# Altium project Peripheral_Board.PrjPcb
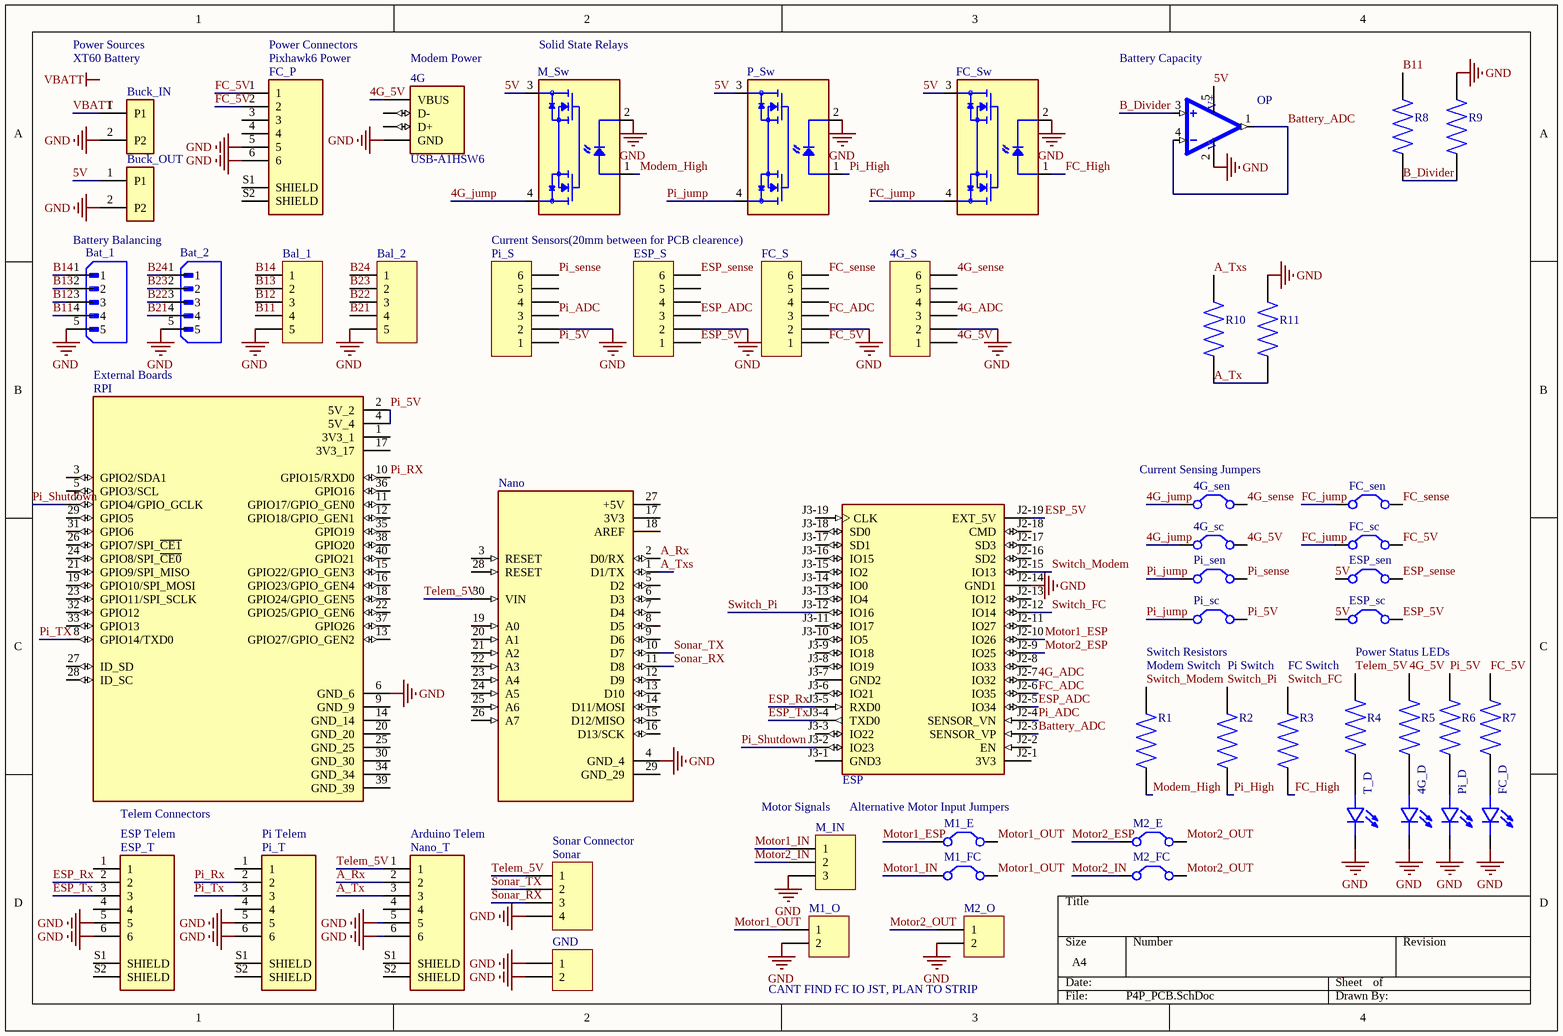
[diagram p0: P4P_PCB.SchDoc]
1 sheet, 54 parts. Net scope: global (net labels, ports and power ports of the same name join across sheets).
Board file: Peripheral_PCB.PcbDoc

## Sheet P4P_PCB.SchDoc
size A4; SheetNumber: 1; SheetTotal: 1

### Parts
4G  USB-A1HSW6  [OST_USB-A1HSW6]
4G_D  SM0603UYC  [LED_SM0603UYC]  (value not drawn)
4G_S  Header 6H  [HDR1X6H]  (value not drawn)
4G_sc  (no value)  [RAD-0.2]
4G_sen  (no value)  [RAD-0.2]
Bal_1  Header 5  [HDR1X5]  (value not drawn)
Bal_2  Header 5  [HDR1X5]  (value not drawn)
Bat_1  B5B-XH-A  [JST_B5B-XH-A]  (value not drawn)
Bat_2  B5B-XH-A  [JST_B5B-XH-A]  (value not drawn)
Buck_IN  1776275-2  [TE_1776275-2]  (value not drawn)
Buck_OUT  1776275-2  [TE_1776275-2]  (value not drawn)
ESP  ESP32-DEVKITC-32D  [MODULE_ESP32-DEVKITC-32D]  (value not drawn)
ESP_S  Header 6H  [HDR1X6H]  (value not drawn)
ESP_sc  (no value)  [RAD-0.2]
ESP_sen  (no value)  [RAD-0.2]
ESP_T  BM06B-GHS-TBT(LF)(SN)(N)  [JST_BM06B-GHS-TBT(LF)(SN)(N)]  (value not drawn)
FC_D  SM0603UYC  [LED_SM0603UYC]  (value not drawn)
FC_P  BM06B-GHS-TBT(LF)(SN)(N)  [JST_BM06B-GHS-TBT(LF)(SN)(N)]  (value not drawn)
FC_S  Header 6H  [HDR1X6H]  (value not drawn)
FC_sc  (no value)  [RAD-0.2]
FC_sen  (no value)  [RAD-0.2]
FC_Sw  G3VM-61VY3  [RELAY_G3VM-61VY3]  (value not drawn)
GND  Header 2  [HDR1X2]  (value not drawn)
M1_E  (no value)  [RAD-0.2]
M1_FC  (no value)  [RAD-0.2]
M1_O  Header 2  [HDR1X2]  (value not drawn)
M2_E  (no value)  [RAD-0.2]
M2_FC  (no value)  [RAD-0.2]
M2_O  Header 2  [HDR1X2]  (value not drawn)
M_IN  Header 3  [HDR1X3]  (value not drawn)
M_Sw  G3VM-61VY3  [RELAY_G3VM-61VY3]  (value not drawn)
Nano  ARDUINO_NANO  [MODULE_ARDUINO_NANO]  (value not drawn)
Nano_T  BM06B-GHS-TBT(LF)(SN)(N)  [JST_BM06B-GHS-TBT(LF)(SN)(N)]  (value not drawn)
OP  MCP6001T-I/OT  [SOT95P270X145-5N]  (value not drawn)
P_Sw  G3VM-61VY3  [RELAY_G3VM-61VY3]  (value not drawn)
Pi_D  SM0603UYC  [LED_SM0603UYC]  (value not drawn)
Pi_S  Header 6H  [HDR1X6H]  (value not drawn)
Pi_sc  (no value)  [RAD-0.2]
Pi_sen  (no value)  [RAD-0.2]
Pi_T  BM06B-GHS-TBT(LF)(SN)(N)  [JST_BM06B-GHS-TBT(LF)(SN)(N)]  (value not drawn)
R1  CR0805AJ/-000EAS  [RESC2012X60N]  (value not drawn)
R2  CR0805AJ/-000EAS  [RESC2012X60N]  (value not drawn)
R3  CR0805AJ/-000EAS  [RESC2012X60N]  (value not drawn)
R4  CR0805AJ/-000EAS  [RESC2012X60N]  (value not drawn)
R5  CR0805AJ/-000EAS  [RESC2012X60N]  (value not drawn)
R6  CR0805AJ/-000EAS  [RESC2012X60N]  (value not drawn)
R7  CR0805AJ/-000EAS  [RESC2012X60N]  (value not drawn)
R8  CR0805AJ/-000EAS  [RESC2012X60N]  (value not drawn)
R9  CR0805AJ/-000EAS  [RESC2012X60N]  (value not drawn)
R10  CR0805AJ/-000EAS  [RESC2012X60N]  (value not drawn)
R11  CR0805AJ/-000EAS  [RESC2012X60N]  (value not drawn)
RPI  RASPBERRY_PI_ZERO_2_W  [MODULE_RASPBERRY_PI_ZERO_2_W]  (value not drawn)
Sonar  Header 4  [HDR1X4]  (value not drawn)
T_D  SM0603UYC  [LED_SM0603UYC]  (value not drawn)

### Nets
GND: 4G.4(GND) 4G_D.C 4G_S.2 Bal_1.5 Bal_2.5 Bat_1.5 Bat_2.5 Buck_IN.2(P2) Buck_OUT.2(P2) ESP.J2-14(GND1) ESP_S.2 ESP_T.5 ESP_T.6 FC_D.C FC_P.5 FC_P.6 FC_S.2 FC_Sw.2(C) GND.1 GND.2 M1_O.2 M2_O.2 M_IN.3 M_Sw.2(C) Nano.4(GND_4) Nano_T.5 Nano_T.6 OP.2(VSS) P_Sw.2(C) Pi_D.C Pi_S.2 Pi_T.5 Pi_T.6 R9.2 R11.2 RPI.6(GND_6) Sonar.4 T_D.C
VBATT: Buck_IN.1(P1)
4G_5V: 4G.1(VBUS) 4G_S.1 4G_sc.2(C2) R5.2
4G_ADC: 4G_S.3 ESP.J2-7(IO32)
4G_jump: 4G_sc.1(C1) 4G_sen.1(C1) M_Sw.4(D1)
4G_sense: 4G_S.6 4G_sen.2(C2)
5V: Buck_OUT.1(P1) ESP_sc.1(C1) ESP_sen.1(C1) FC_Sw.3(D2) M_Sw.3(D2) OP.5(VDD) P_Sw.3(D2)
A_Rx: Nano.2(D0/RX) Nano_T.2
A_Tx: Nano_T.3 R10.2 R11.1
A_Txs: Nano.1(D1/TX) R10.1
B11: Bal_1.4 Bat_1.4 R8.1
B12: Bal_1.3 Bat_1.3
B13: Bal_1.2 Bat_1.2
B14: Bal_1.1 Bat_1.1
B21: Bal_2.4 Bat_2.4
B22: Bal_2.3 Bat_2.3
B23: Bal_2.2 Bat_2.2
B24: Bal_2.1 Bat_2.1
B_Divider: OP.3(VIN+) R8.2 R9.1
Battery_ADC: ESP.J2-3(SENSOR_VP) OP.1(VOUT) OP.4(VIN-)
ESP_5V: ESP.J2-19(EXT_5V) ESP_S.1 ESP_sc.2(C2)
ESP_ADC: ESP.J2-5(IO34) ESP_S.3
ESP_Rx: ESP.J3-5(RXD0) ESP_T.2
ESP_sense: ESP_S.6 ESP_sen.2(C2)
ESP_Tx: ESP.J3-4(TXD0) ESP_T.3
FC_5V: FC_P.1 FC_P.2 FC_S.1 FC_sc.2(C2) R7.2
FC_ADC: ESP.J2-6(IO35) FC_S.3
FC_High: FC_Sw.1(A) R3.1
FC_jump: FC_sc.1(C1) FC_sen.1(C1) FC_Sw.4(D1)
FC_sense: FC_S.6 FC_sen.2(C2)
Modem_High: M_Sw.1(A) R1.1
Motor1_ESP: ESP.J2-10(IO26) M1_E.1(C1)
Motor1_IN: M1_FC.1(C1) M_IN.1
Motor1_OUT: M1_E.2(C2) M1_FC.2(C2) M1_O.1
Motor2_ESP: ESP.J2-9(IO25) M2_E.1(C1)
Motor2_IN: M2_FC.1(C1) M_IN.2
Motor2_OUT: M2_E.2(C2) M2_FC.2(C2) M2_O.1
Pi_5V: Pi_S.1 Pi_sc.2(C2) R6.2 RPI.2(5V_2) RPI.4(5V_4)
Pi_ADC: ESP.J2-4(SENSOR_VN) Pi_S.3
Pi_High: P_Sw.1(A) R2.1
Pi_jump: P_Sw.4(D1) Pi_sc.1(C1) Pi_sen.1(C1)
Pi_RX: Pi_T.2 RPI.10(GPIO15/RXD0)
Pi_sense: Pi_S.6 Pi_sen.2(C2)
Pi_Shutdown: ESP.J3-2(IO23) RPI.7(GPIO4/GPIO_GCLK)
Pi_TX: Pi_T.3 RPI.8(GPIO14/TXD0)
Sonar_RX: Nano.11(D8) Sonar.3
Sonar_TX: Nano.10(D7) Sonar.2
Switch_FC: ESP.J2-12(IO14) R3.2
Switch_Modem: ESP.J2-15(IO13) R1.2
Switch_Pi: ESP.J3-12(IO16) R2.2
Telem_5V: Nano.30(VIN) Nano_T.1 R4.2 Sonar.1
Net4G_D_A: 4G_D.A R5.1
NetFC_D_A: FC_D.A R7.1
NetPi_D_A: Pi_D.A R6.1
NetR4_1: R4.1 T_D.A

Not connected (* = marked no-connect by the designer): 4G 2(D-) 3(D+); 4G_S 4 5; ESP J2-1(3V3) J2-2(EN) J2-8(IO33) J2-11(IO27) J2-13(IO12) J2-16(SD2) J2-17(SD3) J2-18(CMD) J3-1(GND3) J3-3(IO22) J3-6(IO21) J3-7(GND2) J3-8(IO19) J3-9(IO18) J3-10(IO5) J3-11(IO17) J3-13(IO4) J3-14(IO0) J3-15(IO2) J3-16(IO15) J3-17(SD1) J3-18(SD0) J3-19(CLK); ESP_S 4 5; ESP_T 1 4 S1(SHIELD) S2(SHIELD); FC_P 3 4 S1(SHIELD) S2(SHIELD); FC_S 4 5; Nano 3(RESET) 5(D2) 6(D3) 7(D4) 8(D5) 9(D6) 12(D9) 13(D10) 14(D11/MOSI) 15(D12/MISO) 16(D13/SCK) 17(3V3) 18(AREF) 19(A0) 20(A1) 21(A2) 22(A3) 23(A4) 24(A5) 25(A6) 26(A7) 27(+5V) 28(RESET) 29(GND_29); Nano_T 4 S1(SHIELD) S2(SHIELD); Pi_S 4 5; Pi_T 1 4 S1(SHIELD) S2(SHIELD); RPI 1(3V3_1) 3(GPIO2/SDA1) 5(GPIO3/SCL) 9(GND_9) 11(GPIO17/GPIO_GEN0) 12(GPIO18/GPIO_GEN1) 13(GPIO27/GPIO_GEN2) 14(GND_14) 15(GPIO22/GPIO_GEN3) 16(GPIO23/GPIO_GEN4) 17(3V3_17) 18(GPIO24/GPIO_GEN5) 19(GPIO10/SPI_MOSI) 20(GND_20) 21(GPIO9/SPI_MISO) 22(GPIO25/GPIO_GEN6) 23(GPIO11/SPI_SCLK) 24(GPIO8/SPI_~{CE0}) 25(GND_25) 26(GPIO7/SPI_~{CE1}) 27(ID_SD) 28(ID_SC) 29(GPIO5) 30(GND_30) 31(GPIO6) 32(GPIO12) 33(GPIO13) 34(GND_34) 35(GPIO19) 36(GPIO16) 37(GPIO26) 38(GPIO20) 39(GND_39) 40(GPIO21)

### Notes on the sheet
- (near Buck_IN) XT60 Battery
- Power Sources
- (near FC_P) Pixhawk6 Power
- (near FC_P) Power Connectors
- (near 4G) Modem Power
- (near M_Sw) Solid State Relays
- (near OP) Battery Capacity
- Battery Balancing
- Current Sensors(20mm between for PCB clearence)
- External Boards
- (near 4G_sen) Current Sensing Jumpers
- (near Pi_sc) Switch Resistors
- Power Status LEDs
- Modem Switch
- Pi Switch
- FC Switch
- (near RPI) Telem Connectors
- ESP Telem
- Pi Telem
- (near Nano_T) Arduino Telem
- (near Sonar) Sonar Connector
- Motor Signals
- Alternative Motor Input Jumpers
- CANT FIND FC IO JST, PLAN TO STRIP
- Labels drawn without touching a wire or pin: VBATT
- (in symbol MCP6001T-I/OT) V+; V-

### Library data of the parts
4G = USB-A1HSW6: MF: {'manufacturer': u'On Shore Technology Inc.'}; Package: None; Price: None; Value: *; MP: USB-A1HSW6; Availability: Unavailable
4G_D FC_D Pi_D T_D = SM0603UYC: LED SMD 0603 Ultra Yellow 593nm 70mcd Water Clear Lens 130 Deg Viewing Angle | Bivar Inc. SM0603UYC; SnapEDA_Link: https://www.snapeda.com/parts/SM0603UYC/Bivar/view-part/?ref=snap; Package: 0603 Bivar; Value: *; MF: Bivar; MP: SM0603UYC; Check_prices: https://www.snapeda.com/parts/SM0603UYC/Bivar/view-part/?ref=eda
4G_S ESP_S FC_S Pi_S = Header 6H: Header, 6-Pin, Right Angle; LatestRevisionDate: 17-Jul-2002; LatestRevisionNote: Re-released for DXP Platform.; Publisher: Altium Limited
4G_sc 4G_sen ESP_sc ESP_sen FC_sc FC_sen M1_E M1_FC M2_E M2_FC Pi_sc Pi_sen = Jumper: Jumper Wire; Published: 24-Mar-1999; LatestRevisionDate: 17-Jul-2002; LatestRevisionNote: Re-released for DXP Platform.; PackageReference: RAD-0.2; Publisher: Altium Limited; PackageDescription: Radial Cap, Thru-Hole; 2 Leads; 0.2 in Pin Spacing
Bal_1 Bal_2 = Header 5: Header, 5-Pin; LatestRevisionDate: 17-Jul-2002; LatestRevisionNote: Re-released for DXP Platform.; Publisher: Altium Limited
Bat_1 Bat_2 = B5B-XH-A: Connector Header Through Hole 5 position 0.098 (2.50mm); MF: JST Sales; SnapEDA_Link: https://www.snapeda.com/parts/B5B-XH-A/JST+Sales+America+Inc./view-part/?ref=snap; Package: None; Value: *; MP: B5B-XH-A; Check_prices: https://www.snapeda.com/parts/B5B-XH-A/JST+Sales+America+Inc./view-part/?ref=eda
Buck_IN Buck_OUT = 1776275-2: 2 Position Wire to Board Terminal Block Horizontal with Board 0.138" (3.50mm) Through Hole; MF: TE Connectivity; Package: None; Price: None; Value: *; SnapEDA_Link: https://www.snapeda.com/parts/1776275-2/TE+Connectivity+AMP+Connectors/view-part/?ref=snap; MP: 1776275-2; Availability: Unavailable; Check_prices: https://www.snapeda.com/parts/1776275-2/TE+Connectivity+AMP+Connectors/view-part/?ref=eda
ESP = ESP32-DEVKITC-32D: WiFi Development Tools (802.11) ESP32 General Development Kit, ESP32-WROOM-32D on the board; MF: Espressif Systems; SnapEDA_Link: https://www.snapeda.com/parts/ESP32-DEVKITC-32D/Espressif+Systems/view-part/?ref=snap; Package: None; Value: *; MP: ESP32-DEVKITC-32D; Check_prices: https://www.snapeda.com/parts/ESP32-DEVKITC-32D/Espressif+Systems/view-part/?ref=eda
ESP_T FC_P Nano_T Pi_T = BM06B-GHS-TBT(LF)(SN)(N): Connector Header Surface Mount 6 position 0.049 (1.25mm); MF: JST Sales; SnapEDA_Link: https://www.snapeda.com/parts/BM06B-GHS-TBT(LF)(SN)(N)/JST/view-part/?ref=snap; Package: None; Value: *; MP: BM06B-GHS-TBT(LF)(SN)(N); Check_prices: https://www.snapeda.com/parts/BM06B-GHS-TBT(LF)(SN)(N)/JST/view-part/?ref=eda
GND M1_O M2_O = Header 2: Header, 2-Pin; LatestRevisionDate: 17-Jul-2002; LatestRevisionNote: Re-released for DXP Platform.; Publisher: Altium Limited
M_IN = Header 3: Header, 3-Pin; LatestRevisionDate: 17-Jul-2002; LatestRevisionNote: Re-released for DXP Platform.; Publisher: Altium Limited
Nano = ARDUINO_NANO: Small, complete, and breadboard-friendly board based on the ATmega328 (Arduino Nano 3.x); SnapEDA_Link: https://www.snapeda.com/parts/Arduino%20Nano/Arduino/view-part/?ref=snap; Package: Non-Standard Arduino; Value: *; MF: Arduino; MP: Arduino Nano; Check_prices: https://www.snapeda.com/parts/Arduino%20Nano/Arduino/view-part/?ref=eda
OP = MCP6001T-I/OT: Microchip Op Amp, 1MHz CMOS, Rail to Rail, 3 V, 5 V, 5-Pin SOT-23 | Microchip Technology Inc. MCP6001T-I/OT; SnapEDA_Link: https://www.snapeda.com/parts/MCP6001T-I/OT/Microchip/view-part/?ref=snap; Package: SOT-23 Microchip; Value: *; MF: Microchip; MP: MCP6001T-I/OT; Check_prices: https://www.snapeda.com/parts/MCP6001T-I/OT/Microchip/view-part/?ref=eda
R1-R11 = CR0805AJ/-000EAS: Resistor, AS 0805 0R Jumper 125mW, AEC-Q, Anti-Sulfur | Bourns CR0805AJ/-000EAS; SnapEDA_Link: https://www.snapeda.com/parts/CR0805AJ/-000EAS/Bourns/view-part/?ref=snap; Package: 0805 Bourns; Value: *; MF: Bourns; MP: CR0805AJ/-000EAS; Check_prices: https://www.snapeda.com/parts/CR0805AJ/-000EAS/Bourns/view-part/?ref=eda
RPI = RASPBERRY_PI_ZERO_2_W: At the heart of Raspberry Pi Zero 2 W is RP3A0, a custom-built system-in-package designed by Raspberry Pi in the UK.; SnapEDA_Link: https://www.snapeda.com/parts/RASPBERRY%20PI%20ZERO%202%20W/Raspberry+Pi/view-part/?ref=snap; Package: None; Value: *; MF: Raspberry Pi; MP: RASPBERRY PI ZERO 2 W; Check_prices: https://www.snapeda.com/parts/RASPBERRY%20PI%20ZERO%202%20W/Raspberry+Pi/view-part/?ref=eda
Sonar = Header 4: Header, 4-Pin; LatestRevisionDate: 17-Jul-2002; LatestRevisionNote: Re-released for DXP Platform.; Publisher: Altium Limited
FC_Sw M_Sw P_Sw = G3VM-61VY3: Value: *; Price: None; Package: None; Availability: Unavailable; MP: G3VM-61VY3